# Altium schematic sheet 直流电机控制原理图.SCHDOC
size A4
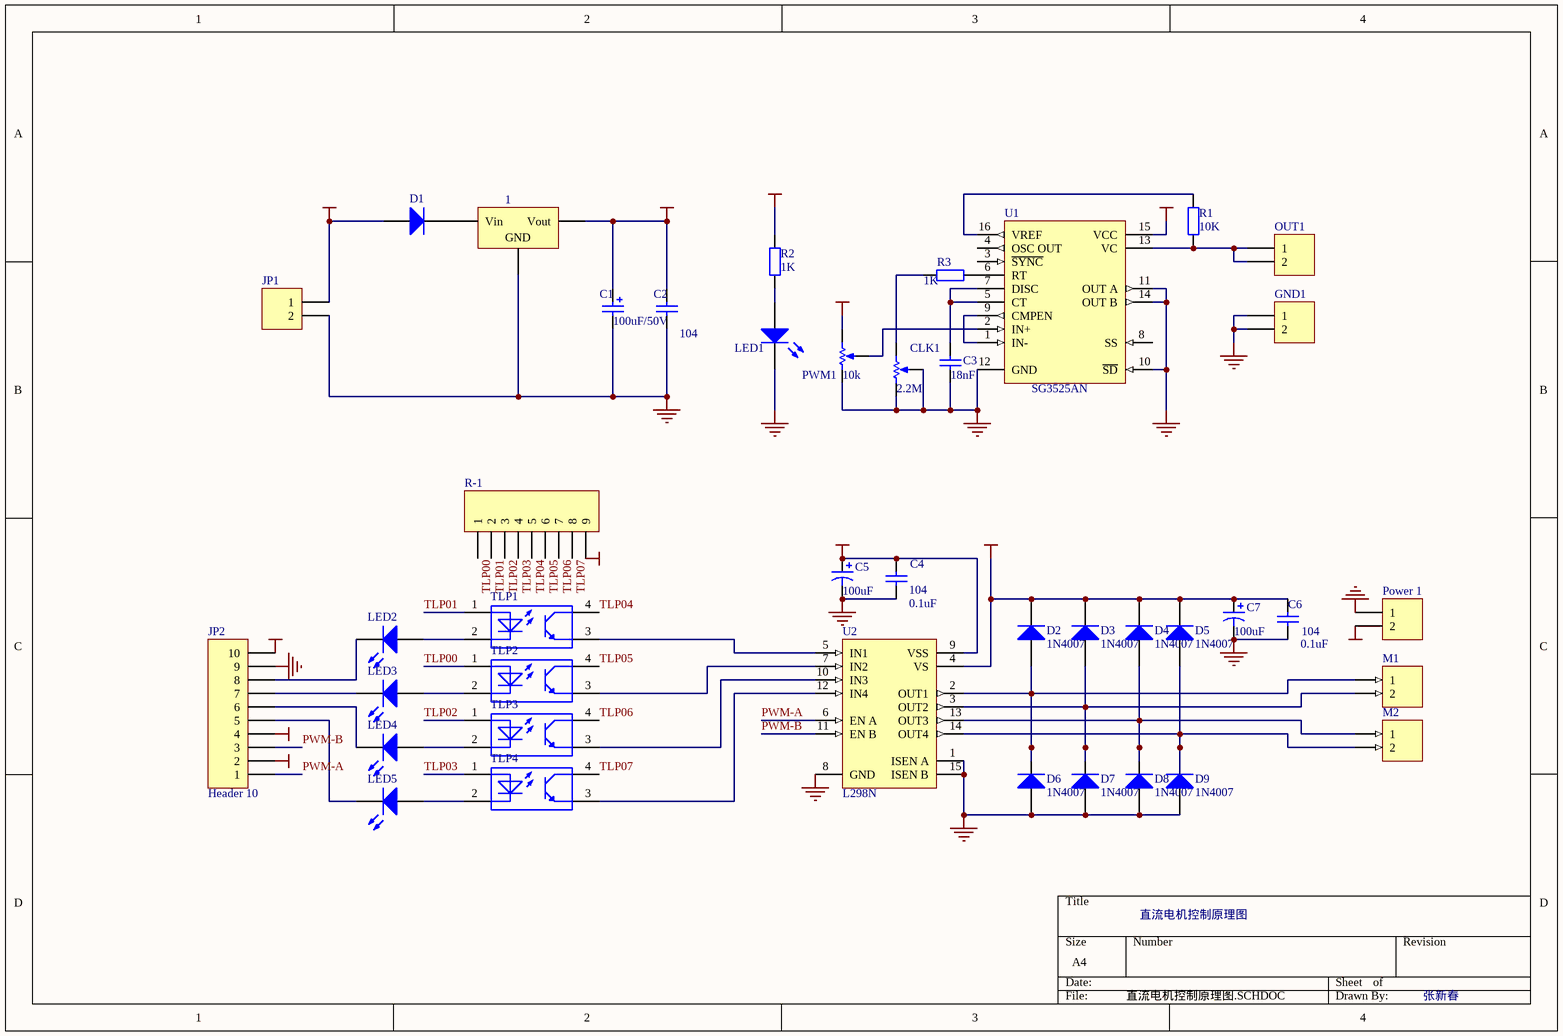
[diagram p0: 直流电机控制原理图.SCHDOC]

## Parts
1  SDWYG  [WYG]  (value not drawn)
C1  value 100uF/50V  [C-DJ-6]  (hidden comment: DJDR)
C2  value 104  [CPDR]  (hidden comment: CPDR)
C3  value 18nF  [CPDR]  (hidden comment: Cap Semi)
C4  104  value 0.1uF  [BAT-2]
C5  value 100uF  [CAPPR2-5x6.8]
C6  104  value 0.1uF  [BAT-2]
C7  value 100uF  [CAPPR2-5x6.8]
CLK1  value 2.2M  [SIP3-D]  (hidden comment: RPot)
D1  Diode 1N4007  [D-ZL-10]  (value not drawn)
D2  1N4007  [DIO7.8-4.6x2]
D3  1N4007  [DIO7.8-4.6x2]
D4  1N4007  [DIO7.8-4.6x2]
D5  1N4007  [DIO7.8-4.6x2]
D6  1N4007  [DIO7.8-4.6x2]
D7  1N4007  [DIO7.8-4.6x2]
D8  1N4007  [DIO7.8-4.6x2]
D9  1N4007  [DIO7.8-4.6x2]
GND1  Header 2  [HDR1X2]  (value not drawn)
JP1  PZ_2  [JK128_2]  (value not drawn)
JP2  Header 10  [HDR1X10]
LED1  LED2  [LED_D]  (value not drawn)
LED2  (no value)  [HDR1X2]
LED3  (no value)  [HDR1X2]
LED4  (no value)  [HDR1X2]
LED5  (no value)  [HDR1X2]
M1  (no value)  [JK128]
M2  (no value)  [JK128]
OUT1  Header 2  [HDR1X2]  (value not drawn)
Power_1  (no value)  [JK128]
PWM1  value 10k  [SIP3-D]  (hidden comment: RPot)
R1  value 10K  [AXIAL-0.4]  (hidden comment: Res2)
R2  value 1K  [AXIAL-0.4]  (hidden comment: Res2)
R3  value 1K  [AXIAL-0.4]  (hidden comment: Res2)
R-1  (no value)  [HDR1X9]
TLP1  (no value)  [DIP4]
TLP2  (no value)  [DIP4]
TLP3  (no value)  [DIP4]
TLP4  (no value)  [DIP4]
U1  SG3525AN  [DIP16]
U2  L298N  [DFM-T15/X1.6V]

## Nets
+5V: C4.2 C5.1 JP2.2 JP2.4 JP2.10 R-1.9 U2.9(VSS)
+12V: C6.2 C7.1 D2.2(K) D3.2(K) D4.2(K) D5.2(K) Power_1.2 U2.4(VS)
GND: 1.3(GND) C1.2 C2.1 C3.2 C4.1 C5.2 CLK1.1(TOP) CLK1.3(TAP) GND1.1 GND1.2 JP1.2 JP2.9 LED1.2(K) PWM1.1(TOP) U1.10(~{SD}) U1.11(OUT_A) U1.12(GND) U1.14(OUT_B) U2.8(GND)
GND-12: C6.1 C7.2 D6.1(A) D7.1(A) D8.1(A) D9.1(A) Power_1.1 U2.1(ISEN_A) U2.15(ISEN_B)
VCC1: D1.1(A) JP1.1 U1.15(VCC)
VCC2: 1.2(Vout) C1.1 C2.2 PWM1.2(BOT) R2.1
PWM-A: JP2.1 U2.6(EN_A)
PWM-B: JP2.3 U2.11(EN_B)
TLP00: R-1.1 TLP2.1
TLP01: R-1.2 TLP1.1
TLP02: R-1.3 TLP3.1
TLP03: R-1.4 TLP4.1
TLP04: R-1.5 TLP1.4
TLP05: R-1.6 TLP2.4
TLP06: R-1.7 TLP3.4
TLP07: R-1.8 TLP4.4
Net1_1: 1.1(Vin) D1.2(K)
NetC3_1: C3.1 U1.5(CT) U1.7(DISC)
NetCLK1_2: CLK1.2(BOT) R3.2
NetD2_1: D2.1(A) D6.2(K) M1.1 U2.2(OUT1)
NetD3_1: D3.1(A) D7.2(K) M1.2 U2.3(OUT2)
NetD4_1: D4.1(A) D8.2(K) M2.1 U2.13(OUT3)
NetD5_1: D5.1(A) D9.2(K) M2.2 U2.14(OUT4)
NetJP2_5: JP2.5 LED5.2(K)
NetJP2_6: JP2.6 LED4.2(K)
NetJP2_7: JP2.7 LED3.2(K)
NetJP2_8: JP2.8 LED2.2(K)
NetLED1_1: LED1.1(A) R2.2
NetLED2_1: LED2.1(A) TLP1.2
NetLED3_1: LED3.1(A) TLP2.2
NetLED4_1: LED4.1(A) TLP3.2
NetLED5_1: LED5.1(A) TLP4.2
NetOUT1_1: OUT1.1 OUT1.2 R1.1 U1.13(VC)
NetPWM1_3: PWM1.3(TAP) U1.2(IN+)
NetR1_2: R1.2 U1.16(VREF)
NetR3_1: R3.1 U1.6(RT)
NetTLP1_3: TLP1.3 U2.5(IN1)
NetTLP2_3: TLP2.3 U2.7(IN2)
NetTLP3_3: TLP3.3 U2.10(IN3)
NetTLP4_3: TLP4.3 U2.12(IN4)
NetU1_1: U1.1(IN-) U1.9(CMPEN)

Not connected (* = marked no-connect by the designer): U1 3(~{SYNC}) 4(OSC_OUT) 8(SS)

## Notes on the sheet
- 直流电机控制原理图
- 张新春

## Library data of the parts
1 = SDWYG: 三端稳压器; Published: 24-Mar-1999; LatestRevisionDate: 17-Jul-2002; LatestRevisionNote: Re-released for DXP Platform.; Publisher: Altium Limited; Code_JEDEC: SMD-220
C1 = DJDR: 电解电容; Published: 8-Jun-2000; LatestRevisionDate: 17-Jul-2002; LatestRevisionNote: Re-released for DXP Platform.; Publisher: Altium Limited
C2 = CPDR: 瓷片电容; Published: 8-Jun-2000; LatestRevisionDate: 17-Jul-2002; LatestRevisionNote: Re-released for DXP Platform.; Publisher: Altium Limited
C3 = Cap Semi: Capacitor (Semiconductor SIM Model); Published: 8-Jun-2000; LatestRevisionDate: 17-Jul-2002; LatestRevisionNote: Re-released for DXP Platform.; PackageReference: C1206; Publisher: Altium Limited
C4 C6 = Cap: Capacitor; Published: 8-Jun-2000; LatestRevisionDate: 17-Jul-2002; LatestRevisionNote: Re-released for DXP Platform.; Publisher: Altium Limited
C5 C7 = Cap Pol3: Polarized Capacitor (Surface Mount); Published: 8-Jun-2000; LatestRevisionDate: 17-Jul-2002; LatestRevisionNote: Re-released for DXP Platform.; PackageReference: C0805; Publisher: Altium Limited
CLK1 PWM1 = RPot: Potentiometer; Sim Note: Enter the Resistance value and the set point into parameter fields.; Set Position: 0.5; Published: 8-Jun-2000; LatestRevisionDate: 17-Jul-2002; LatestRevisionNote: Re-released for DXP Platform.; Publisher: Altium Limited
D1-D9 = Diode 1N4007: 1 Amp General Purpose Rectifier; Published: 8-Jun-2000; LatestRevisionDate: 17-Jul-2002; LatestRevisionNote: Re-released for DXP Platform.; DatasheetDocument: 1998; PackageDocument: Aug-1999; PackageReference: DO-41; Publisher: Altium Limited; Code_JEDEC: DO-204-AL
GND1 OUT1 = Header 2: Header, 2-Pin; LatestRevisionDate: 17-Jul-2002; LatestRevisionNote: Re-released for DXP Platform.; Publisher: Altium Limited
JP1 = PZ_2: 排针——2; LatestRevisionDate: 17-Jul-2002; LatestRevisionNote: Re-released for DXP Platform.; Publisher: Altium Limited
JP2 = Header 10: Header, 10-Pin; LatestRevisionDate: 17-Jul-2002; LatestRevisionNote: Re-released for DXP Platform.; Publisher: Altium Limited
LED1 = LED2: Typical RED, GREEN, YELLOW, AMBER GaAs LED; Published: 8-Jun-2000; LatestRevisionDate: 17-Jul-2002; LatestRevisionNote: Re-released for DXP Platform.; Publisher: Altium Limited
LED2-LED5 = LED3: Typical BLUE SiC LED; Published: 8-Jun-2000; LatestRevisionDate: 17-Dec-2003; LatestRevisionNote: PCB Footprint replaced.; Publisher: Altium Limited
M1 M2 Power_1 = MHDR1X2: Header, 2-Pin; LatestRevisionDate: 17-Jul-2002; LatestRevisionNote: Re-released for DXP Platform.; Publisher: Altium Limited
R1-R3 = Res2: Resistor; Published: 8-Jun-2000; LatestRevisionDate: 17-Jul-2002; LatestRevisionNote: Re-released for DXP Platform.; Publisher: Altium Limited
R-1 = Header 9: Header, 9-Pin; Revision: 17-Jul-2002: Re-released for DXP Platform.; Publisher: Altium Limited
TLP1-TLP4 = TLP521-1
U1 = SG3525AN: Pulse Width Modulator Control Circuit; Published: 15-Apr-2002; DatasheetDocument: 1996; PackageDocument: Apr-2000; PackageReference: 648-08; Publisher: Altium Limited; Code_JEDEC: MS-001-BB
U2 = L298N: Dual Full Bridge Driver; Published: 8-Jun-2000; LatestRevisionDate: 17-Jul-2002; LatestRevisionNote: Re-released for DXP Platform.; DatasheetDocument: Jul-1999; PackageDocument: Apr-1998; PackageReference: Multiwatt15H; Publisher: Altium Limited; ComponentLink1Description: Manufacturer Link; ComponentLink1URL: http://www.st.com/